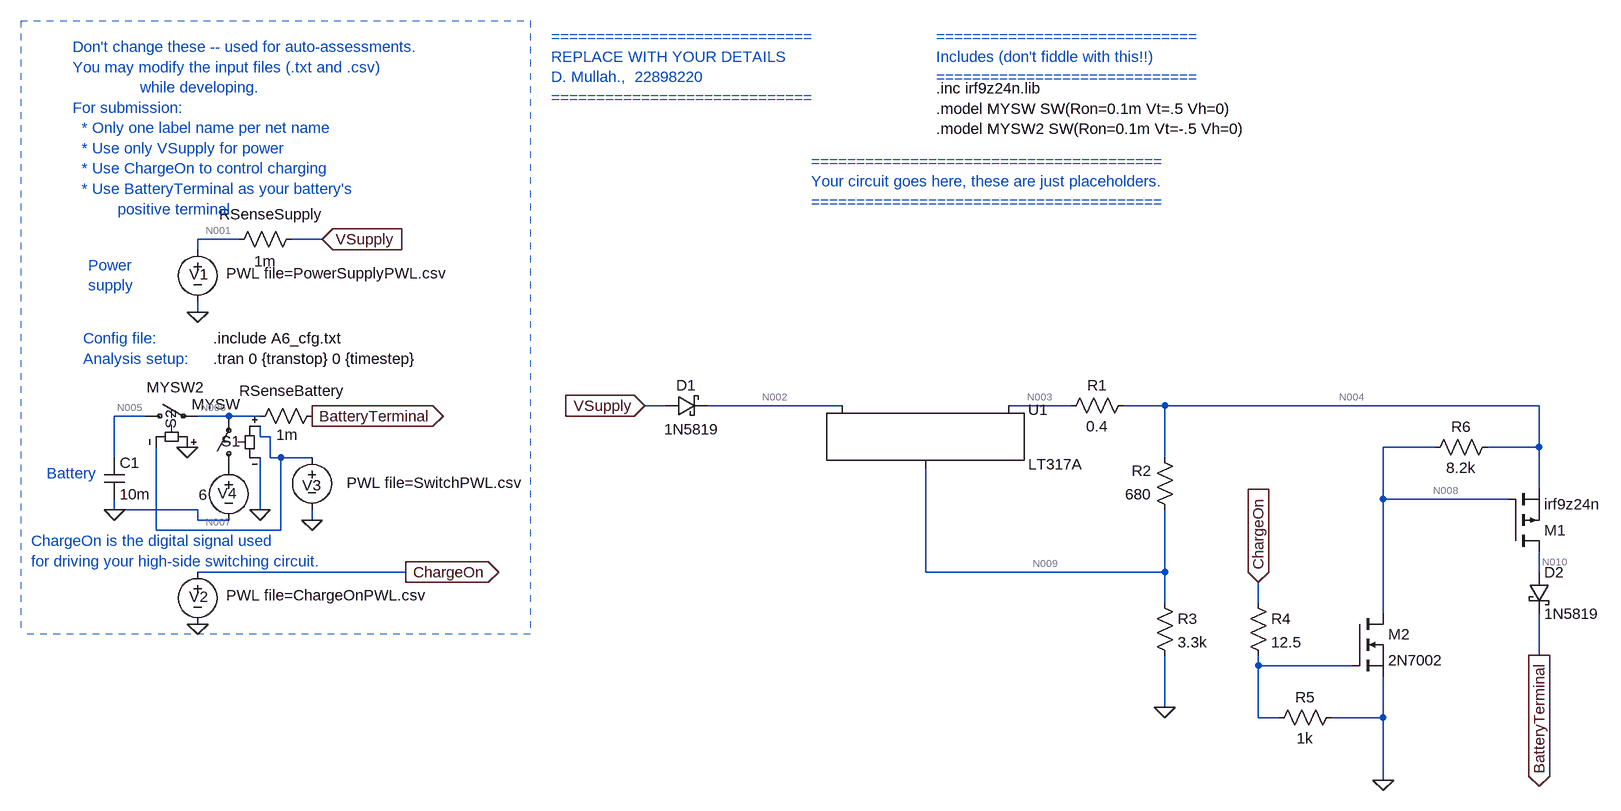
[diagram p0: schematic E344_12345678_A6b.asc]
E344_12345678_A6b.asc, the LTspice schematic file:
Version 4
SHEET 1 1824 680
WIRE -2032 -1088 -2096 -1088
WIRE -1904 -1088 -1952 -1088
WIRE -2096 -1072 -2096 -1088
WIRE -2096 -976 -2096 -992
WIRE -1376 -832 -1408 -832
WIRE -1104 -832 -1312 -832
WIRE -752 -832 -848 -832
WIRE -608 -832 -672 -832
WIRE -32 -832 -608 -832
WIRE -2176 -816 -2224 -816
WIRE -2048 -816 -2096 -816
WIRE -2000 -816 -2048 -816
WIRE -2000 -784 -2000 -800
WIRE -1984 -784 -2000 -784
WIRE -192 -768 -272 -768
WIRE -32 -768 -32 -832
WIRE -32 -768 -112 -768
WIRE -2224 -752 -2224 -816
WIRE -1984 -752 -1984 -784
WIRE -1968 -752 -1984 -752
WIRE -1920 -752 -1968 -752
WIRE -608 -752 -608 -832
WIRE -32 -704 -32 -768
WIRE -272 -688 -272 -768
WIRE -80 -688 -272 -688
WIRE -2224 -672 -2224 -688
WIRE -2096 -672 -2224 -672
WIRE -2000 -672 -2000 -752
WIRE -2096 -656 -2096 -672
WIRE -2048 -656 -2096 -656
WIRE -1920 -656 -1920 -672
WIRE -2160 -640 -2160 -768
WIRE -1968 -640 -1968 -752
WIRE -1968 -640 -2160 -640
WIRE -1776 -576 -2096 -576
WIRE -976 -576 -976 -736
WIRE -608 -576 -608 -672
WIRE -608 -576 -976 -576
WIRE -32 -576 -32 -608
WIRE -608 -528 -608 -576
WIRE -464 -528 -464 -560
WIRE -272 -512 -272 -688
WIRE -32 -448 -32 -512
WIRE -464 -432 -464 -448
WIRE -320 -432 -464 -432
WIRE -608 -368 -608 -448
WIRE -464 -352 -464 -432
WIRE -432 -352 -464 -352
WIRE -272 -352 -272 -416
WIRE -272 -352 -352 -352
WIRE -272 -256 -272 -352
FLAG -2096 -976 0
FLAG -1904 -1088 VSupply
IOPIN -1904 -1088 In
FLAG -1920 -816 BatteryTerminal
IOPIN -1920 -816 Out
FLAG -1776 -576 ChargeOn
IOPIN -1776 -576 Out
FLAG -2096 -496 0
FLAG -1408 -832 VSupply
IOPIN -1408 -832 In
FLAG -32 -448 BatteryTerminal
IOPIN -32 -448 Out
FLAG -464 -560 ChargeOn
IOPIN -464 -560 In
FLAG -2000 -672 0
FLAG -1920 -656 0
FLAG -2112 -768 0
FLAG -2224 -672 0
FLAG -608 -368 0
FLAG -272 -256 0
SYMBOL voltage -2096 -1088 R0
WINDOW 123 0 0 Left 0
WINDOW 39 0 0 Left 0
WINDOW 3 44 52 Left 2
WINDOW 0 -13 54 Left 2
SYMATTR Value PWL file=PowerSupplyPWL.csv
SYMATTR InstName V1
SYMBOL res -1904 -832 R90
WINDOW 0 -7 47 VBottom 2
WINDOW 3 29 54 VTop 2
SYMATTR InstName RSenseBattery
SYMATTR Value 1m
SYMBOL res -1936 -1104 R90
WINDOW 0 -7 47 VBottom 2
WINDOW 3 34 56 VTop 2
SYMATTR InstName RSenseSupply
SYMATTR Value 1m
SYMBOL cap -2240 -752 R0
SYMATTR InstName C1
SYMATTR Value 10m
SYMATTR SpiceLine2 IC=6
SYMBOL voltage -2096 -592 R0
WINDOW 123 0 0 Left 0
WINDOW 39 0 0 Left 0
WINDOW 3 44 52 Left 2
WINDOW 0 -13 54 Left 2
SYMATTR Value PWL file=ChargeOnPWL.csv
SYMATTR InstName V2
SYMBOL PowerProducts\\LT317A -976 -832 R0
SYMATTR InstName U1
SYMBOL pmos -80 -608 M180
SYMATTR InstName M1
SYMATTR Value irf9z24n
SYMATTR Prefix X
SYMATTR SpiceModel irf9z24n
SYMBOL nmos -320 -512 R0
SYMATTR InstName M2
SYMATTR Value 2N7002
SYMBOL schottky -1376 -816 R270
WINDOW 0 32 32 VTop 2
WINDOW 3 -5 40 VBottom 2
SYMATTR InstName D1
SYMATTR Value 1N5819
SYMATTR Description Diode
SYMATTR Type diode
SYMBOL schottky -48 -576 R0
SYMATTR InstName D2
SYMATTR Value 1N5819
SYMATTR Description Diode
SYMATTR Type diode
SYMBOL sw -2048 -720 R180
WINDOW 0 -18 57 Left 2
WINDOW 3 -17 114 Left 2
SYMATTR InstName S1
SYMATTR Value MYSW
SYMBOL voltage -1920 -768 R0
WINDOW 0 0 43 Top 2
WINDOW 3 188 70 Bottom 2
WINDOW 123 0 0 Left 0
WINDOW 39 0 0 Left 0
SYMATTR InstName V3
SYMATTR Value PWL file=SwitchPWL.csv
SYMBOL sw -2192 -816 R270
WINDOW 0 -20 55 Left 2
WINDOW 3 44 18 VRight 2
SYMATTR InstName S2
SYMATTR Value MYSW2
SYMBOL voltage -2048 -752 R0
WINDOW 0 -17 55 Left 2
WINDOW 3 -46 57 Left 2
WINDOW 123 0 0 Left 0
WINDOW 39 0 0 Left 0
SYMATTR InstName V4
SYMATTR Value 6
SYMBOL res -656 -848 R90
WINDOW 0 0 56 VBottom 2
WINDOW 3 32 56 VTop 2
SYMATTR InstName R1
SYMATTR Value 0.4
SYMBOL res -592 -656 R180
WINDOW 0 36 76 Left 2
WINDOW 3 36 40 Left 2
SYMATTR InstName R2
SYMATTR Value 680
SYMBOL res -624 -544 R0
SYMATTR InstName R3
SYMATTR Value 3.3k
SYMBOL res -480 -544 R0
SYMATTR InstName R4
SYMATTR Value 12.5
SYMBOL res -336 -368 R90
WINDOW 0 0 56 VBottom 2
WINDOW 3 32 56 VTop 2
SYMATTR InstName R5
SYMATTR Value 1k
SYMBOL res -96 -784 R90
WINDOW 0 0 56 VBottom 2
WINDOW 3 32 56 VTop 2
SYMATTR InstName R6
SYMATTR Value 8.2k
TEXT -2072 -904 Left 2 !.tran 0 {transtop} 0 {timestep}
TEXT -2072 -936 Left 2 !.include A6_cfg.txt
TEXT -2288 -1384 Left 2 ;Don't change these -- used for auto-assessments.\nYou may modify the input files (.txt and .csv) \n               while developing.\nFor submission: \n  * Only one label name per net name\n  * Use only VSupply for power\n  * Use ChargeOn to control charging\n  * Use BatteryTerminal as your battery's \n          positive terminal
TEXT -2272 -936 Left 2 ;Config file:
TEXT -2272 -904 Left 2 ;Analysis setup:
TEXT -2328 -728 Left 2 ;Battery
TEXT -2264 -1048 Left 2 ;Power\nsupply
TEXT -1552 -1400 Left 2 ;=============================\nREPLACE WITH YOUR DETAILS\nD. Mullah.,  22898220\n=============================
TEXT -960 -1320 Left 2 !.inc irf9z24n.lib\n.model MYSW SW(Ron=0.1m Vt=.5 Vh=0)\n.model MYSW2 SW(Ron=0.1m Vt=-.5 Vh=0)
TEXT -2352 -624 Left 2 ;ChargeOn is the digital signal used \nfor driving your high-side switching circuit.
TEXT -960 -1400 Left 2 ;=============================\nIncludes (don't fiddle with this!!)\n=============================
TEXT -1152 -1208 Left 2 ;=======================================\nYour circuit goes here, these are just placeholders.\n=======================================
LINE Normal -1584 -1424 -1584 -480 2
LINE Normal -2368 -1424 -1584 -1424 2
LINE Normal -1584 -480 -2368 -480 2
LINE Normal -1584 -496 -1584 -496 2
LINE Normal -2368 -1424 -2368 -480 2

The netlist it stands for:
* E344_12345678_A6b.asc
V1 N001 0 PWL file=PowerSupplyPWL.csv
RSenseBattery BatteryTerminal N006 1m
RSenseSupply VSupply N001 1m
C1 N005 0 10m IC=6
V2 ChargeOn 0 PWL file=ChargeOnPWL.csv
XU1 N009 N003 N002 LT317A
XM1 N010 N008 N004 irf9z24n irf9z24n  ; pins D G S
M2 N008 N011 0 0 2N7002
D1 VSupply N002 1N5819
D2 N010 BatteryTerminal 1N5819
S1 P001 N006 N007 0 MYSW
V3 N007 0 PWL file=SwitchPWL.csv
S2 N005 N006 0 N007 MYSW2
V4 P001 0 6
R1 N004 N003 0.4
R2 N009 N004 680
R3 N009 0 3.3k
R4 ChargeOn N011 12.5
R5 0 N011 1k
R6 N004 N008 8.2k
.model D D
.lib standard.dio
.model NMOS NMOS
.model PMOS PMOS
.lib standard.mos
.tran 0 {transtop} 0 {timestep}
.include A6_cfg.txt
* Don't change these -- used for auto-assessments.
* You may modify the input files (.txt and .csv)
*                while developing.
* For submission:
*   * Only one label name per net name
*   * Use only VSupply for power
*   * Use ChargeOn to control charging
*   * Use BatteryTerminal as your battery's
*           positive terminal
* Config file:
* Analysis setup:
* Battery
* Power
* supply
* =============================
* REPLACE WITH YOUR DETAILS
* D. Mullah.,  22898220
* =============================
.inc irf9z24n.lib
.model MYSW SW(Ron=0.1m Vt=.5 Vh=0)
.model MYSW2 SW(Ron=0.1m Vt=-.5 Vh=0)
* ChargeOn is the digital signal used
* for driving your high-side switching circuit.
* =============================
* Includes (don't fiddle with this!!)
* =============================
* =======================================
* Your circuit goes here, these are just placeholders.
* =======================================
.lib LTC.lib
.backanno
.end

* Results of the author's LTspice run, read from the files saved beside the schematic
* Operating Point, zero values left out:
*   V(n001) = 12 V
*   V(batteryterminal) = 6 V
*   V(n006) = 6 V
*   V(vsupply) = 12 V
*   V(n005) = 6 V
*   V(n002) = 11.85 V
*   V(n003) = 7.456 V
*   V(n009) = 6.208 V
*   V(n004) = 7.455 V
*   V(n010) = 6.001 V
*   V(n008) = 7.455 V
*   V(p001) = 6 V
*   V(n007) = 1 V
*   Id(M2) = 7.486 pA
*   Is(M2) = -7.486 pA
*   I(D2) = 661.1 nA
*   I(D1) = 1.882 mA
*   I(R6) = 16.4 pA
*   I(R3) = 1.881 mA
*   I(R2) = -1.834 mA
*   I(R1) = -1.834 mA
*   I(Rsensesupply) = -1.882 mA
*   I(Rsensebattery) = 661.1 nA
*   I(S1) = 661.1 nA
*   I(V4) = 661.1 nA
*   I(V1) = -1.882 mA
*   Ix(u1:1) = -47.54 µA
*   Ix(u1:2) = -1.834 mA
*   Ix(u1:3) = 1.882 mA
*   Ix(m1:1) = -661.1 nA
*   Ix(m1:2) = 1.454 pA
*   Ix(m1:3) = 661.1 nA
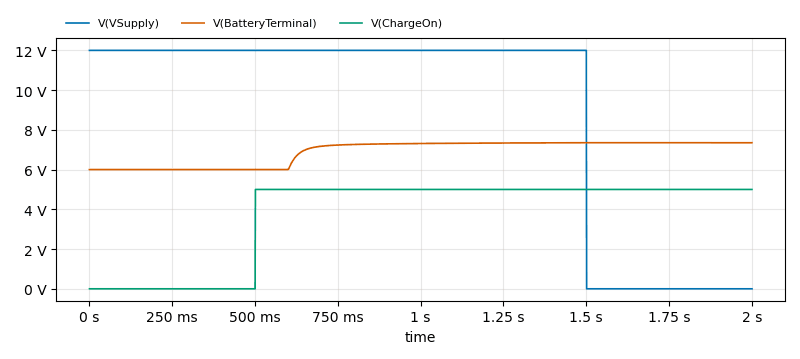
[diagram p1: Transient Analysis of E344_12345678_A6b.asc, plotted from the saved traces]
* Transient Analysis, 1 run:
*   V(VSupply): min 0 V, max 12 V, average 9.003 V, rms 10.39 V, last 0 V
*   V(BatteryTerminal): min 6 V, max 7.352 V, average 6.906 V, rms 6.932 V, last 7.351 V
*   V(ChargeOn): min 0 V, max 5 V, average 3.749 V, rms 4.329 V, last 5 V